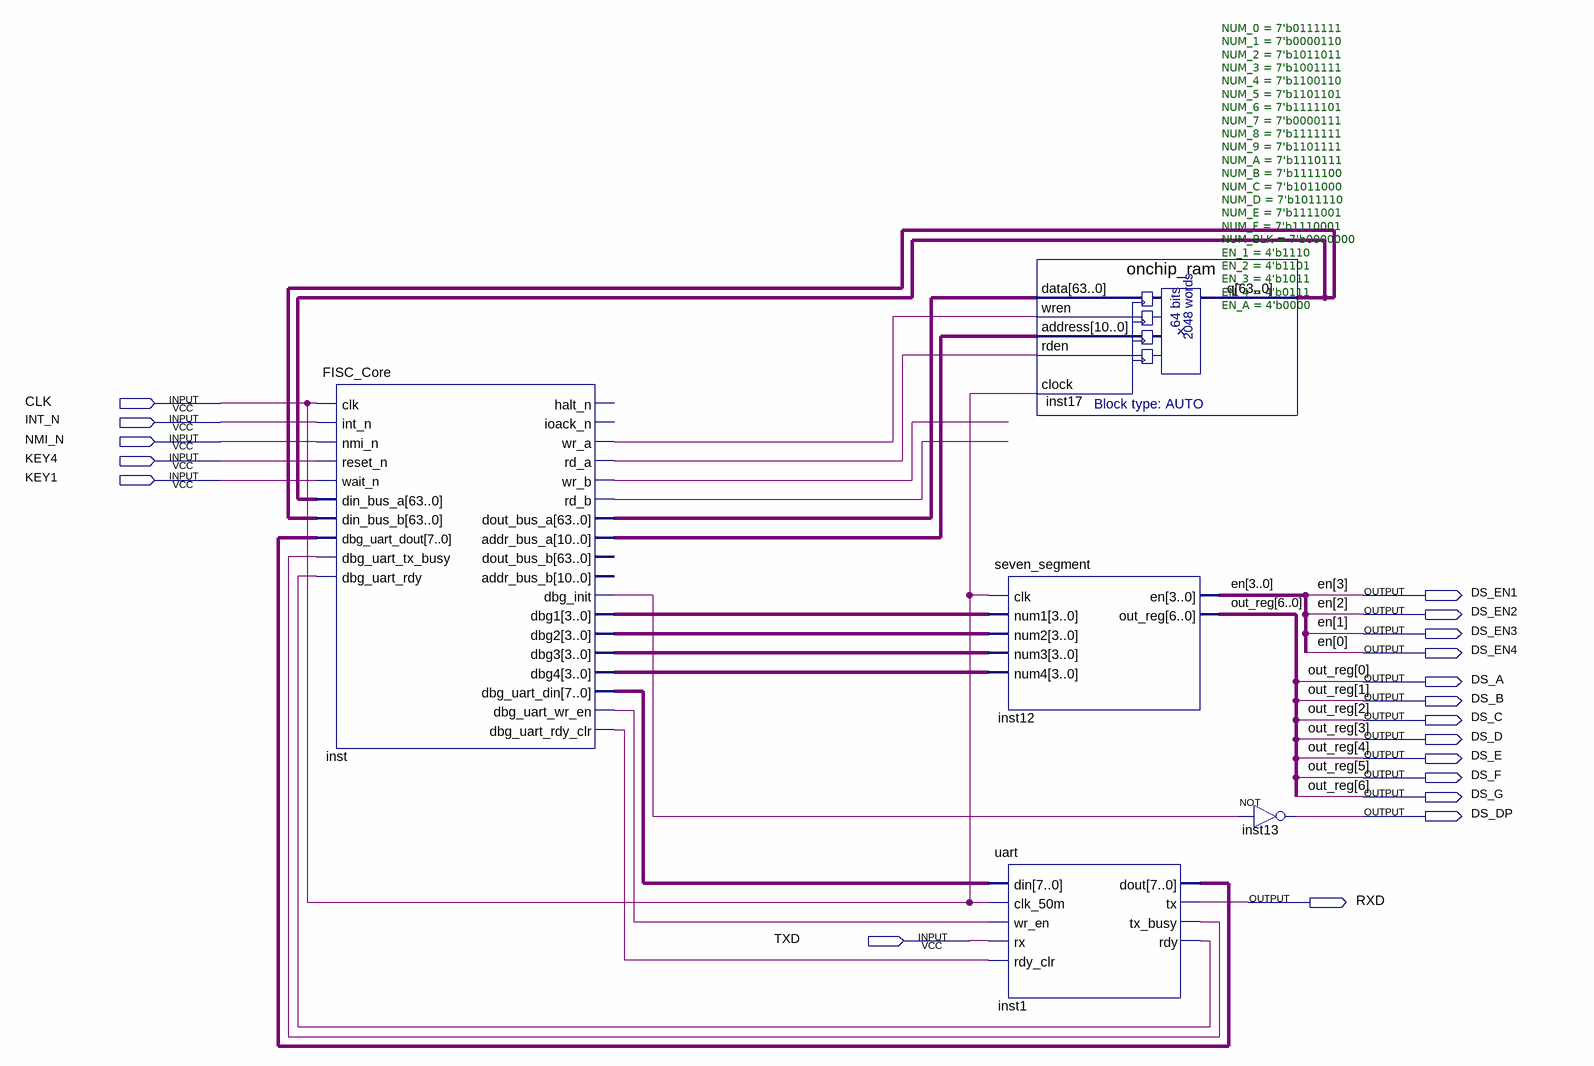
[diagram p0: schematic sheet]
// Quartus schematic top.bdf as structural Verilog: 5 symbols, 19 pins
module top (
  input  CLK,
  input  INT_N,
  input  NMI_N,
  input  KEY4,
  input  KEY1,
  input  TXD,
  output DS_EN1,
  output DS_EN2,
  output DS_EN3,
  output DS_EN4,
  output DS_A,
  output DS_B,
  output DS_C,
  output DS_D,
  output DS_E,
  output DS_F,
  output DS_G,
  output DS_DP,
  output RXD
);

  wire inst1_rdy, inst1_tx_busy, inst_dbg_init, inst_dbg_uart_rdy_clr, inst_dbg_uart_wr_en, inst_rd_a,
       inst_rd_b, inst_wr_a, inst_wr_b;
  wire [3:0] inst_dbg1, inst_dbg2, inst_dbg3, inst_dbg4;
  wire [7:0] inst1_dout, inst_dbg_uart_din;
  wire [10:0] inst_addr_bus_a;
  wire [63:0] inst17_q, inst_dout_bus_a;

  FISC_Core inst (
    .clk(CLK), .int_n(INT_N), .nmi_n(NMI_N), .reset_n(KEY4), .wait_n(KEY1), .din_bus_a(inst17_q),
    .din_bus_b(inst17_q), .dbg_uart_dout(inst1_dout), .dbg_uart_tx_busy(inst1_tx_busy),
    .dbg_uart_rdy(inst1_rdy), .wr_a(inst_wr_a), .rd_a(inst_rd_a), .wr_b(inst_wr_b), .rd_b(inst_rd_b),
    .dout_bus_a(inst_dout_bus_a), .addr_bus_a(inst_addr_bus_a), .dbg_init(inst_dbg_init), .dbg1(inst_dbg1),
    .dbg2(inst_dbg2), .dbg3(inst_dbg3), .dbg4(inst_dbg4), .dbg_uart_din(inst_dbg_uart_din),
    .dbg_uart_wr_en(inst_dbg_uart_wr_en), .dbg_uart_rdy_clr(inst_dbg_uart_rdy_clr));  // open: halt_n, ioack_n, dout_bus_b, addr_bus_b
  seven_segment #(.NUM_0(7'b0111111), .NUM_1(7'b0000110), .NUM_2(7'b1011011), .NUM_3(7'b1001111), .NUM_4(7'b1100110), .NUM_5(7'b1101101), .NUM_6(7'b1111101), .NUM_7(7'b0000111), .NUM_8(7'b1111111), .NUM_9(7'b1101111), .NUM_A(7'b1110111), .NUM_B(7'b1111100), .NUM_C(7'b1011000), .NUM_D(7'b1011110), .NUM_E(7'b1111001), .NUM_F(7'b1110001), .NUM_BLK(7'b0000000), .EN_1(4'b1110), .EN_2(4'b1101), .EN_3(4'b1011), .EN_4(4'b0111), .EN_A(4'b0000)) inst12 (
    .clk(CLK), .num1(inst_dbg1), .num2(inst_dbg2), .num3(inst_dbg3), .num4(inst_dbg4),
    .en({DS_EN1, DS_EN2, DS_EN3, DS_EN4}), .out_reg({DS_G, DS_F, DS_E, DS_D, DS_C, DS_B, DS_A}));
  uart inst1 (
    .din(inst_dbg_uart_din), .clk_50m(CLK), .wr_en(inst_dbg_uart_wr_en), .rx(TXD),
    .rdy_clr(inst_dbg_uart_rdy_clr), .dout(inst1_dout), .tx(RXD), .tx_busy(inst1_tx_busy), .rdy(inst1_rdy));
  onchip_ram inst17 (
    .data(inst_dout_bus_a), .wren(inst_wr_a), .address(inst_addr_bus_a), .rden(inst_rd_a), .clock(CLK),
    .q(inst17_q));
  not inst13 (DS_DP, inst_dbg_init);

  // Other names for the same wires on the sheet: en[3:0] = {DS_EN1, DS_EN2, DS_EN3, DS_EN4};
  //   out_reg[6:0] = {DS_G, DS_F, DS_E, DS_D, DS_C, DS_B, DS_A}
endmodule
